# EAGLE design McPiFace-MiniOled-V1 (EAGLE 7.4.0)
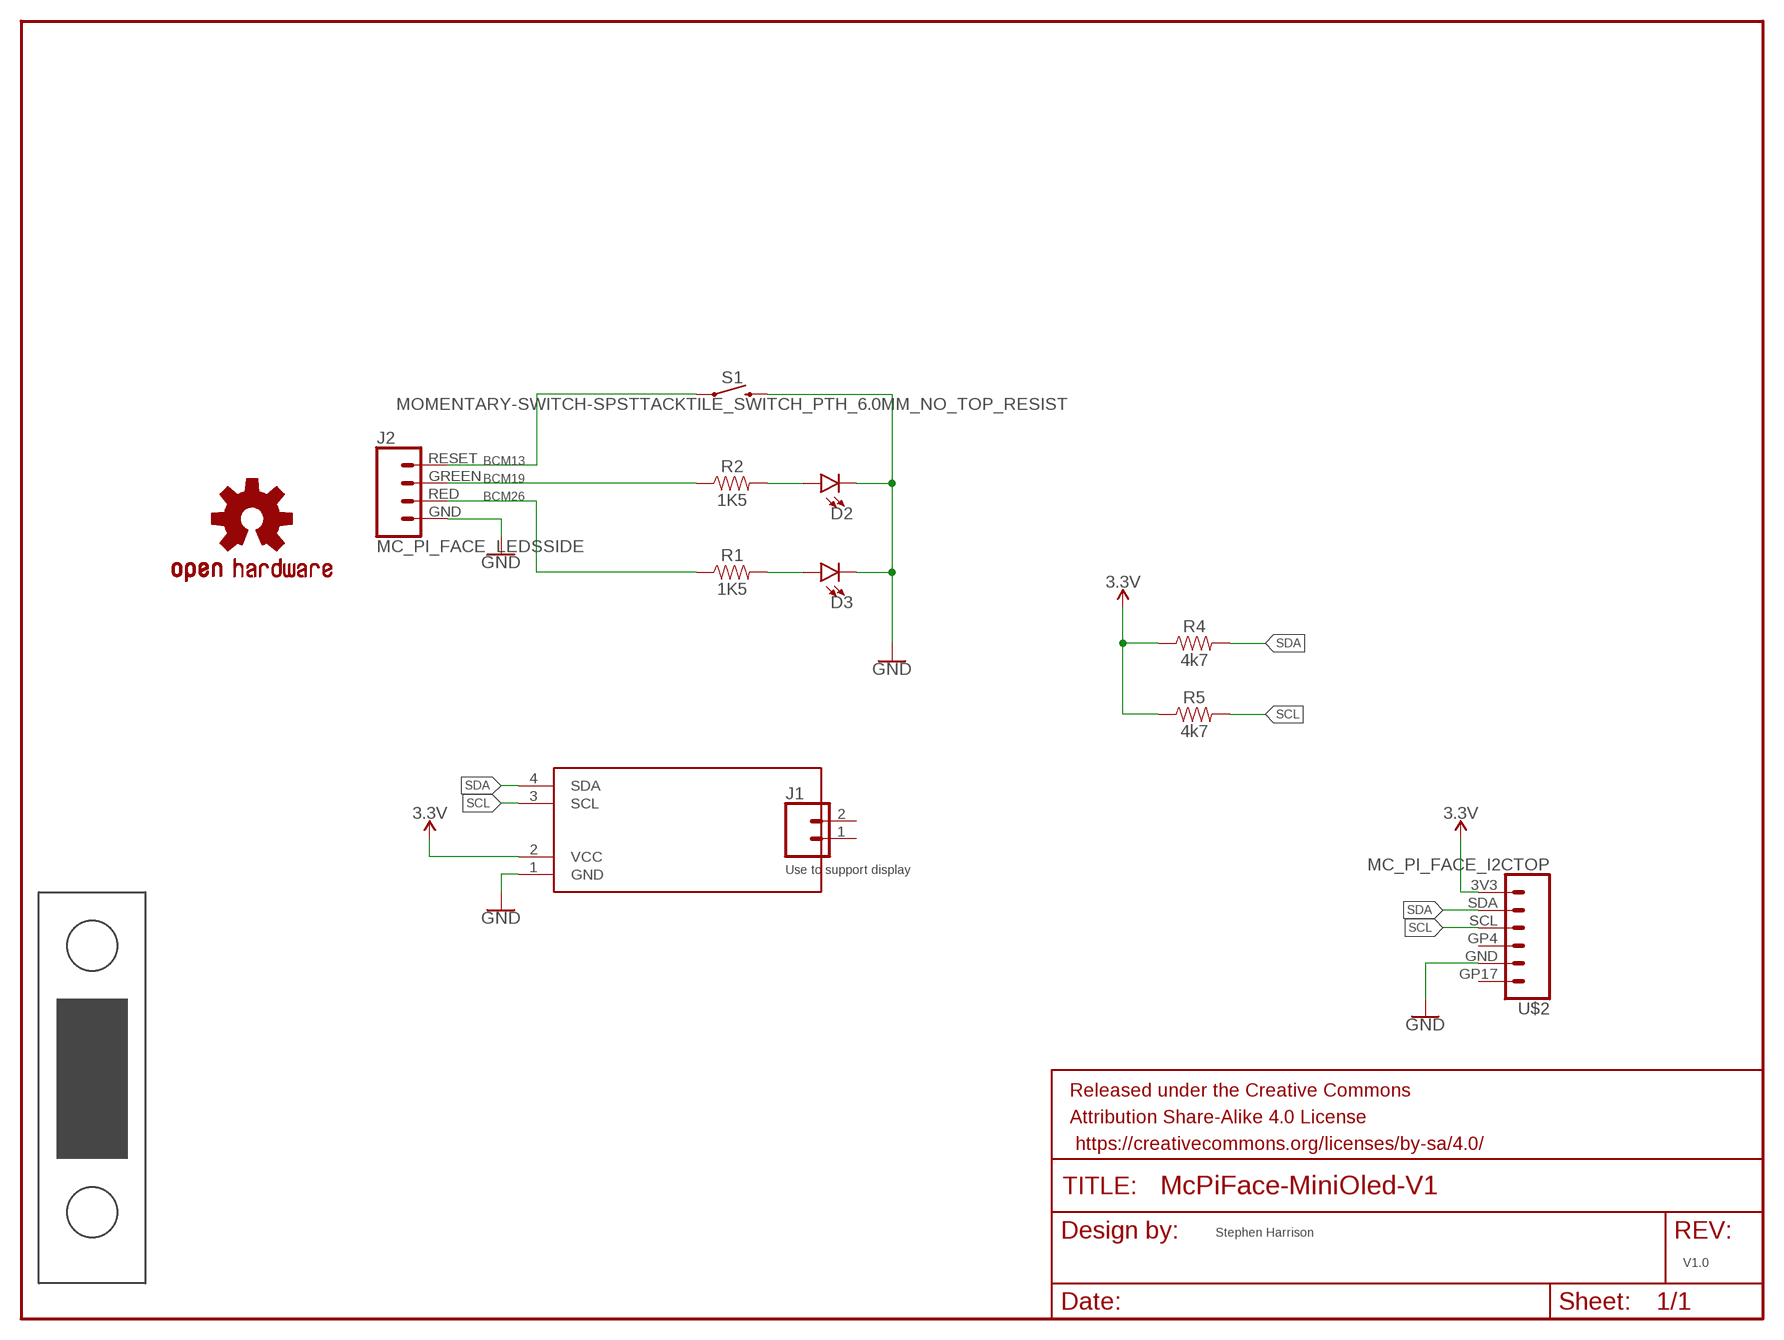
[diagram p0: schematic, sheet 1]

## Parts
D2  LEDLED-1206-BOTTOM-2.0MM-GREEN  [LED-1206-BOTTOM-2.0MM]
D3  LEDLED-1206-BOTTOM-2.0MM-RED  [LED-1206-BOTTOM-2.0MM]
DISPLAY  DISPLAY0.91_INCH_DISPLAY  [I2C_DISPLAY_0.91_INCH]
FRAME1  FRAME-LETTER  [CREATIVE_COMMONS]
J1  CONN_021X02_NO_SILK  [1X02_NO_SILK]
J2  MC_PI_FACE_LEDSSIDE  [JST-4-SH-1.0MM-SIDE]
LOGO1  OSHW-LOGOL  [OSHW-LOGO-L]
R1  1K5  RESISTOR0805  [0805]
R2  1K5  RESISTOR0805  [0805]
R4  4k7  RESISTOR0805  [0805]
R5  4k7  RESISTOR0805  [0805]
S1  MOMENTARY-SWITCH-SPSTTACKTILE_SWITCH_PTH_6.0MM_NO_TOP_RESIST  [TACTILE_SWITCH_PTH_6.0MM_NO_TOP_RESIST]
U$1  MC_PI_FACE_JOINT  [MC_PI_FACE_JOINT]
U$2  MC_PI_FACE_I2CTOP  [JST-6-SH-1.0MM-TOP]

## Nets
3.3V: DISPLAY.2(VCC) R4.1 R5.1 U$2.3V3
BCM13: J2.RESET S1.1
BCM19: J2.GREEN R2.1
BCM26: J2.RED R1.1
GND: D2.C D3.C DISPLAY.1(GND) J2.GND S1.3 U$2.GND
N$1: D3.A R1.2
N$3: D2.A R2.2
SCL: DISPLAY.3(SCL) R5.2 U$2.SCL
SDA: DISPLAY.4(SDA) R4.2 U$2.SDA
Unconnected: J1.1 J1.2 U$2.GP4 U$2.GP17

## Notes on the sheet
- Use to support display
- Stephen Harrison
- V1.0

## Library data of the parts
D2 = ThingySticks:LED: LED (Generic) Standard schematic elements and footprints for 5mm, 3mm, 1206, and 0603 sized LEDs. Generic LEDs with no color specified.; FARNELL: 2217905
D3 = ThingySticks:LED: LED (Generic) Standard schematic elements and footprints for 5mm, 3mm, 1206, and 0603 sized LEDs. Generic LEDs with no color specified.; FARNELL: 2217903
DISPLAY = ThingySticks:DISPLAY
FRAME1 = SparkFun-Aesthetics:FRAME-LETTER: Schematic Frame - Letter Standard 8.5x11 US Letter frame
J1 = SparkFun-Connectors:CONN_02: Multi connection point. Often used as Generic Header-pin footprint for 0.1 inch spaced/style header connections On any of the 0.1 inch spaced packages, you can populate with these: Break Away Headers - Straight <https://www.sparkfun.com/products/116> (PRT-00116) Break Away Male Headers - Right Angle <https://www.sparkfun.com/products/553> (PRT-00553) Female Headers <https://www.sparkfun.com/products/115> (PRT-00115) Break Away Headers - Machine Pin <https://www.sparkfun.com/products/117> (PRT-00117) Break Away Female Headers - Swiss Machine Pin <https://www.sparkfun.com/products/743> (PRT-00743) For SCREWTERMINALS and SPRING TERMINALS visit here: Screw Terimnals on SparkFun.com <https://www.sparkfun.com/search/results?term=Screw+Terminals> (5mm/3.5mm/2.54mm spacing) This device is also useful as a general connection point to wire up your design to another part of your project. Our various solder wires solder well into these plated through hole pads. Hook-Up Wire - Assortment (Stranded, 22 AWG) <https://www.sparkfun.com/products/11375> (PRT-11375) Hook-Up Wire - Assortment (Solid Core, 22 AWG) <https://www.sparkfun.com/products/11367> (PRT-11367) View the entire wire category on our website here <https://www.sparkfun.com/categories/141> Special notes: Molex polarized connector foot print use with: PRT-08233 with associated crimp pins and housings. 2.54_SCREWTERM for use with PRT-10571. 3.5mm Screw Terminal footprints for PRT-08084 5mm Screw Terminal footprints for use with PRT-08432
J2 = McPiFace:MC_PI_FACE_LEDS; FARNELL: 1830839; MFG: SM04B-SRSS-TB(LF)(SN)
LOGO1 = SparkFun-Aesthetics:OSHW-LOGO: Open-Source Hardware (OSHW) Logo This logo indicates the piece of hardware it is found on incorporates a OSHW license and/or adheres to the definition of open source hardware found here: http://freedomdefined.org/OSHW
R1 R2 R4 R5 = SparkFun-Resistors:RESISTOR: Generic Resistor Package
S1 = ThingySticks:MOMENTARY-SWITCH-SPST: Momentary Switch (Pushbutton) - SPST Normally-open (NO) SPST momentary switches (buttons, pushbuttons). Variants PTH-12MM - 12mm square, through-hole Momentary Pushbutton Switch - 12mm Square <https://www.sparkfun.com/products/9190> (COM-09190) PTH-6.0MM, PTH-6.0MM-KIT - 6.0mm square, through-hole Mini Pushbutton Switch <https://www.sparkfun.com/products/97> (COM-00097) KIT package intended for soldering kit's - only one side of pads' copper is exposed. PTH-RIGHT-ANGLE-KIT - Right-angle, through-hole Right Angle Tactile Button <https://www.sparkfun.com/products/10791> - Used on SparkFun BigTime Watch Kit <https://www.sparkfun.com/products/11734> SMD-12MM - 12mm square, surface-mount Tactile Button - SMD (12mm) <https://www.sparkfun.com/products/12993> (COM-12993) Used on SparkFun PicoBoard <https://www.sparkfun.com/products/11888> SMD-4.5MM - 4.5mm Square Trackball Switch Used on SparkFun Blackberry Trackballer Breakout <https://www.sparkfun.com/products/13169> SMD-4.6MMX2.8MM - 4.60mm x 2.80mm, surface mount Used on SparkFun SAMD21 Mini Breakout <https://www.sparkfun.com/products/13664> SMD-5.2MM, SMD-5.2-REDUNDANT - 5.2mm square, surface-mount Mini Pushbutton Switch - SMD <https://www.sparkfun.com/products/8720> (COM-08720) Used on Arduino Pro Mini <https://www.sparkfun.com/products/11114> REDUNDANT package connects both switch circuits together SMD-6.0X3.5MM - 6.0 x 3.5mm, surface mount Momentary Reset Switch SMD <https://www.sparkfun.com/products/8229> (COM-08229) SMD-6.2MM-TALL - 6.2mm square, surface mount Tactile Button - SMD (6mm) <https://www.sparkfun.com/products/12992> Used on SparkFun Digital Sandbox <https://www.sparkfun.com/products/12651> SMD-RIGHT-ANGLE - Right-angle, surface mount Used on SparkFun Block for Intel® Edison - Arduino <https://www.sparkfun.com/products/13036>
U$1 = McPiFace:MC_PI_FACE_JOINT
U$2 = McPiFace:MC_PI_FACE_I2C

## Board
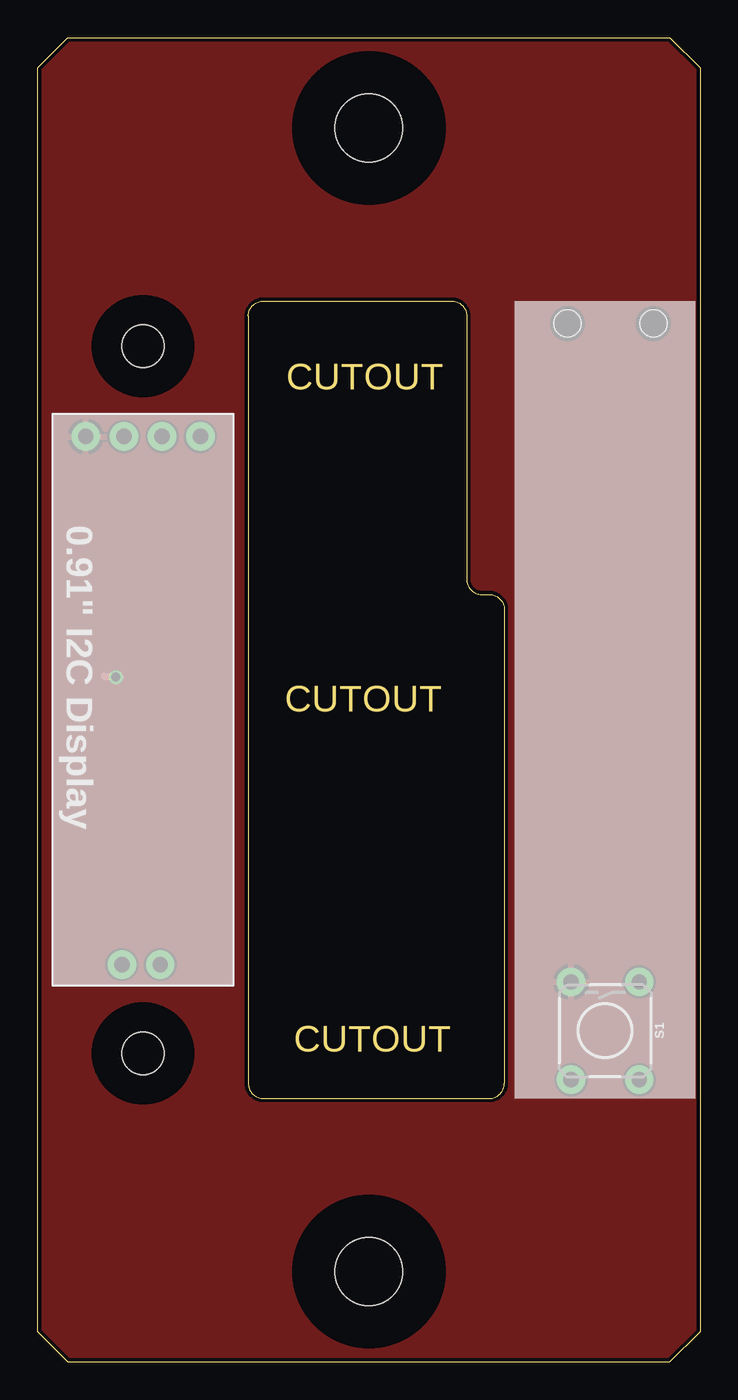
[diagram p1: board, top side]
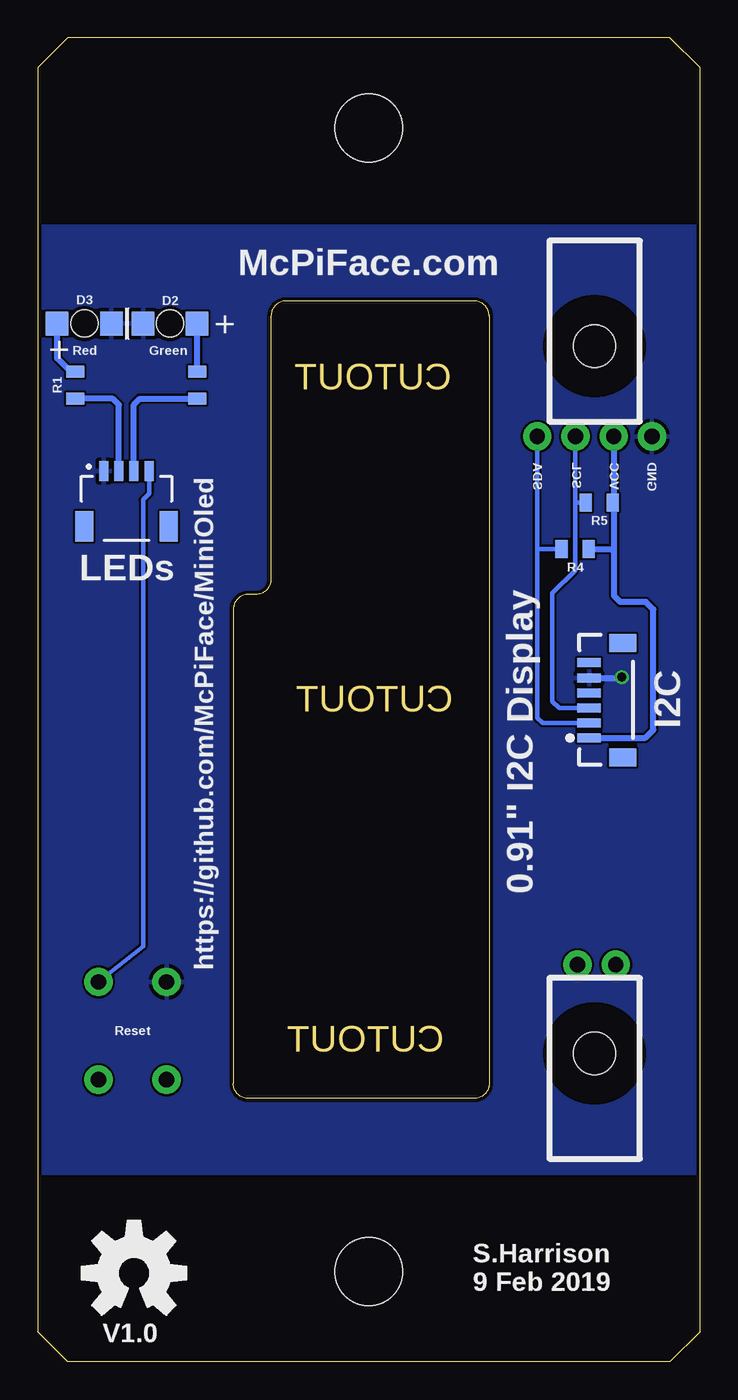
[diagram p2: board, bottom side, seen from below]

Size 44 x 88 mm. Coordinates in mm from the lower left corner, seen from the top.
Copper layers (1*16): Top 0.035mm / dielectric 1.5mm / Bottom 0.035mm
Design rules "dirt_cheap_dirty_boards.v1.1": minimum track width 6mil, minimum drill 12mil, track to track 6mil, track to pad 6mil, pad to pad 6mil, via to via 6mil, smd to smd 0mil, copper to edge 10mil, drill to drill 10mil, minimum pad ring 10mil, minimum via ring 6mil, stop-mask expansion 2mil, vias tented up to drill 25mil, thermal gap 10mil
tRestrict: area 17,77 to 27,87; area 17,1 to 27,11
bRestrict: area -0.5,-0.4 to 44.6,12.4; area -0.2,75.6 to 44.4,88.2

### Footprints (pad centres in the part's own frame; a part is rotated, then mirrored left to right if it is on the bottom)
LED-1206-BOTTOM-2.0MM = smd 1.5 x 1.6: A -1.8,0; C 1.8,0 | hole 1.8: 0,0
I2C_DISPLAY_0.91_INCH = drill 1.016 pad 1.88: 1 1.5,2.19; 2 1.5,4.73; 3 1.5,7.27; 4 1.5,9.81
1X02_NO_SILK = drill 1.016 pad 1.88: 1 0,0; 2 2.54,0
JST-4-SH-1.0MM-SIDE = smd 0.6 x 1.35: GND -1.5,0; GREEN 0.5,0; RED -0.5,0; RESET 1.5,0 | smd 1.2 x 2: NC1 2.8,-3.675; NC2 -2.8,-3.675
0805 = smd 0.8 x 1.2: 1 -0.9,0; 2 0.9,0
TACTILE_SWITCH_PTH_6.0MM_NO_TOP_RESIST = drill 1.016 pad 1.88: 1 -3.251,2.261; 2 3.251,2.261; 3 -3.251,-2.261; 4 3.251,-2.261
MC_PI_FACE_JOINT = hole 2.8: 7,20.5; 7,67.5 | hole 4.5: 22,6; 22,82
JST-6-SH-1.0MM-TOP = smd 0.6 x 1.55: 3V3 -2.54,1.27; GND 1.46,1.27; GP4 0.46,1.27; GP17 2.46,1.27; SCL -0.54,1.27; SDA -1.54,1.27 | smd 1.2 x 1.8: P$1 -3.84,-0.955; P$2 3.76,-0.955

### Placement (x,y rotation side)
D2  35.2,69 180 bottom
D3  40.9,69 0 bottom
DISPLAY  1,63 270 top
FRAME1  1.4,-18.1 0 top  (outside the outline)
J1  5.6,26.4 0 top
J2  38.1,59.2 0 bottom
LOGO1  37.6,5.9 0 bottom
R1  41.5,64.9 90 bottom
R2  33.4,64.9 90 bottom
R4  8.3,54 180 bottom
R5  6.7,57.1 180 bottom
S1  37.7,22 270 top
U$1  0,0 0 top
U$2  6.1,44 90 bottom

### Tracks (layer width: path | path; a pad name or v marks a point on that pad's centre or on a via)
3.3V
  Bottom 0.406: U$2.3V3 3.64,41.46 3.1,42 3.1,50 3.6,50.5 5.3,50.5 5.7,50.9 5.7,53.8 | 5.7,53.8 5.7,57.1 | 5.7,57.1 5.7,61.47 DISPLAY.2 | R5.1 5.7,57.1 | R4.1 5.9,54 5.7,53.8
BCM13
  Bottom 0.305: 36.6,59.3 36.6,57.7 37,57.3 37,27.61 S1.1
  Bottom 0.406: J2.RESET 36.6,59.3
BCM19
  Bottom 0.406: J2.GREEN 37.6,63.6 37.2,64 R2.1
BCM26
  Bottom 0.406: J2.RED 38.6,63.6 39,64 R1.1
GND  (via drill 0.6)
  Top 0.406: v5.2,45.5 4.5,45.5 4.4,45.6
  Bottom 0.406: U$2.GND 5.24,45.46 v5.2,45.5
  pour Top: -1,88.5 45,88.5 45,-1 -1,-1
  pour Bottom: -1,88.5 45,88.5 45,-1 -1,-1
N$1
  Bottom 0.406: R1.2 41.8,65.8 42.7,66.7 D3.A
N$3
  Bottom 0.406: R2.2 D2.A
SCL
  Bottom 0.305: U$2.SCL 9.36,43.46 9.8,43.9 9.8,51.1 8.3,52.6 8.3,57.1 | 8.3,57.1 8.3,61.47 | R5.2 8.3,57.1
  Bottom 0.406: 8.3,61.47 DISPLAY.3
SDA
  Bottom 0.305: U$2.SDA 10.46,42.46 10.8,42.8 10.8,54 | 10.8,54 DISPLAY.4 | R4.2 10.8,54
  Bottom 0.406: DISPLAY.4

### Text on the board
tNames: 0.91" I2C Display
bNames: McPiFace.com | + | Green | Red | + | https://github.com/McPiFace/MiniOled | LEDs | I2C | 0.91" I2C Display | Reset | S.Harrison / 9 Feb 2019 | V1.0